# EAGLE design Metro M4 Express AirLift (EAGLE 9.3.2)
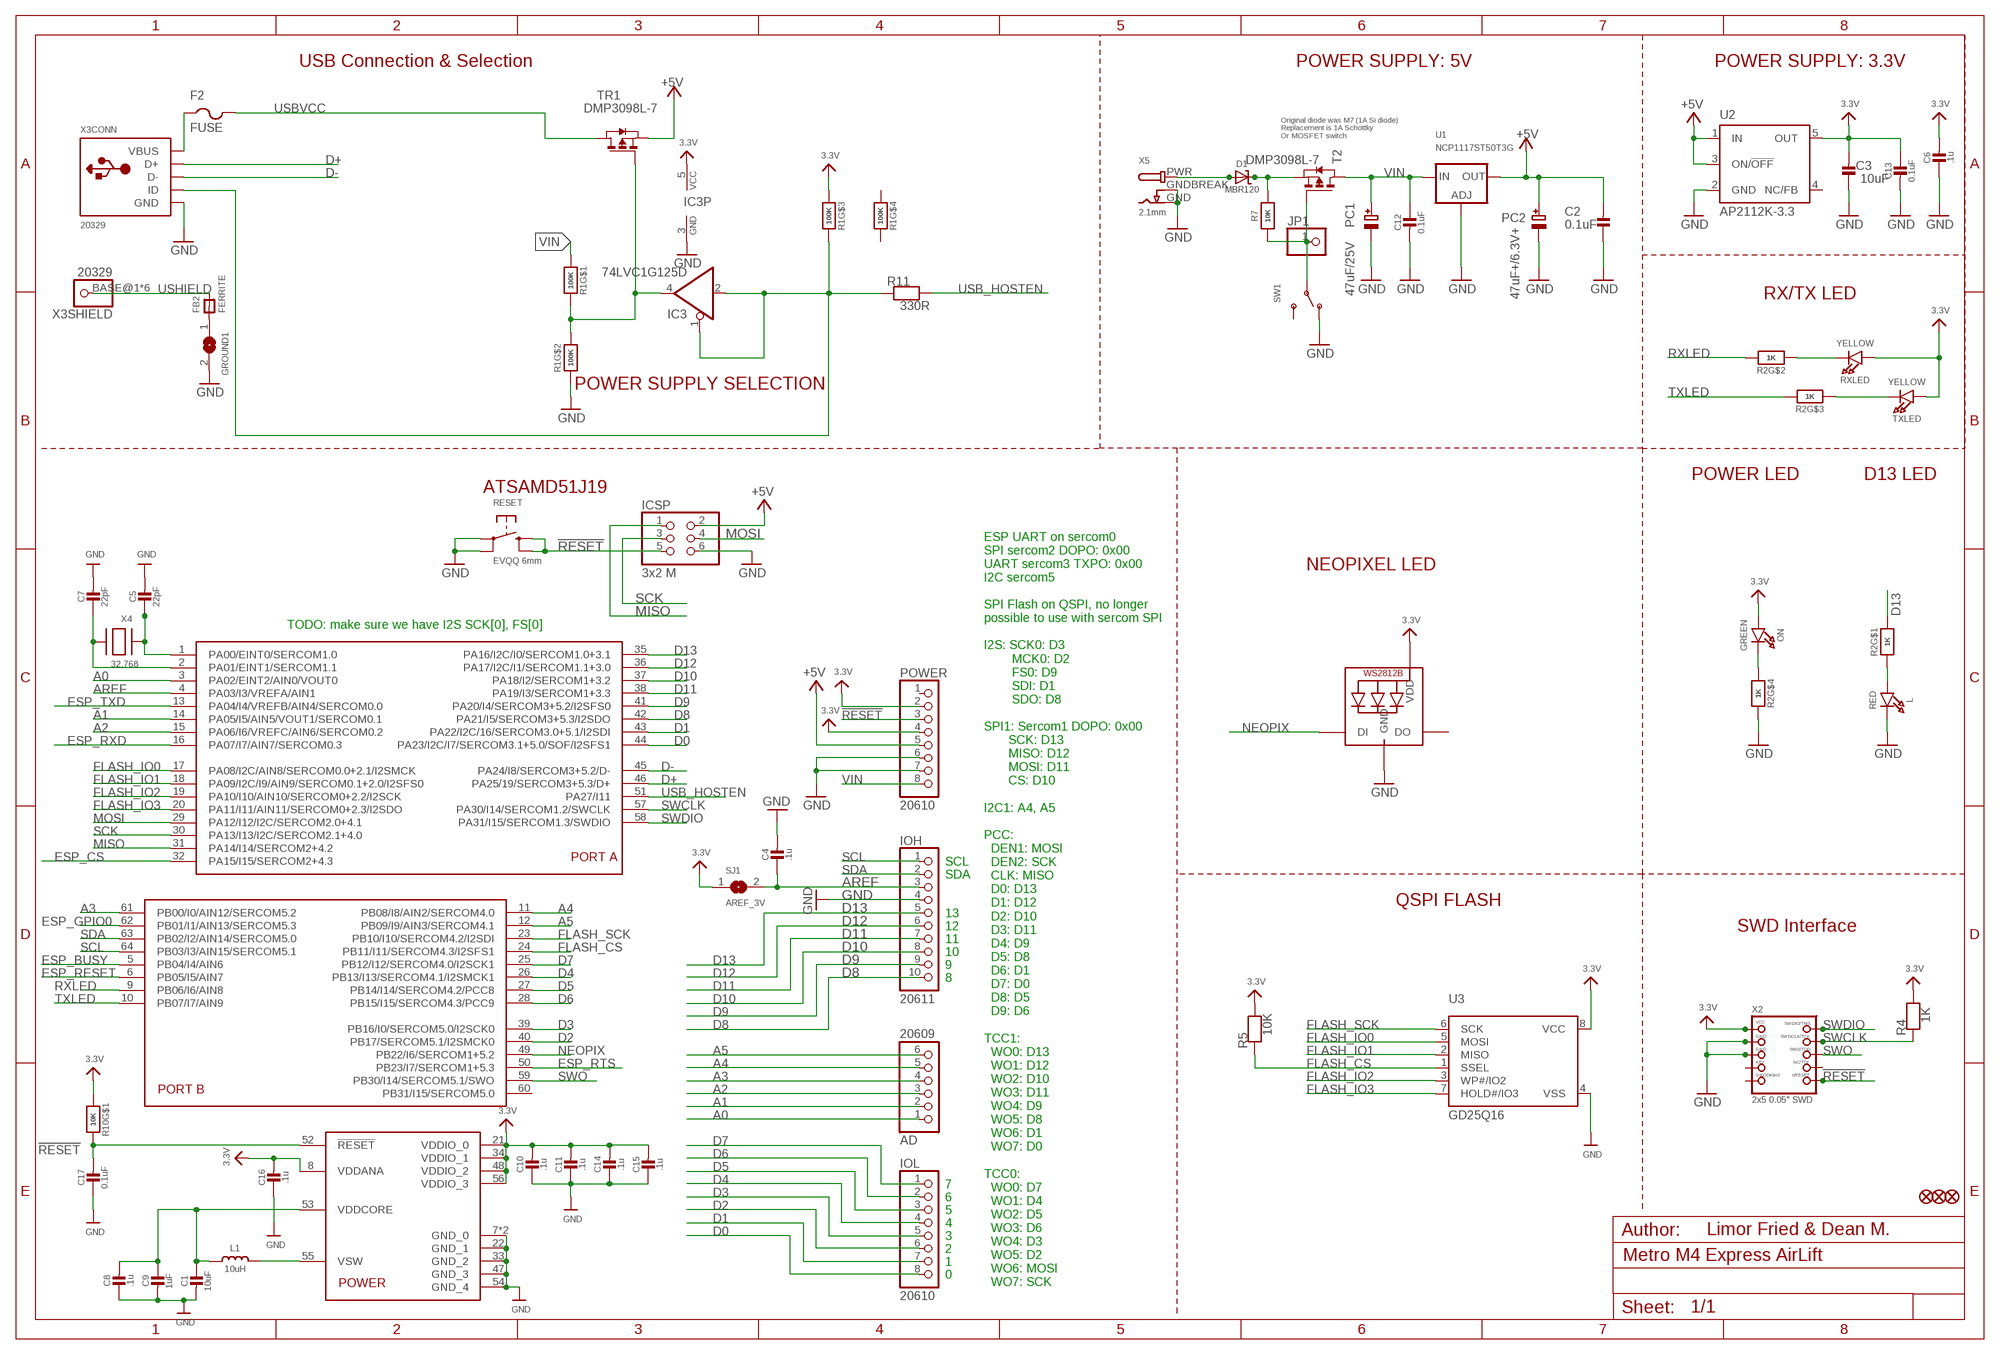
[diagram p0: schematic, sheet 1, part 1 of 2]
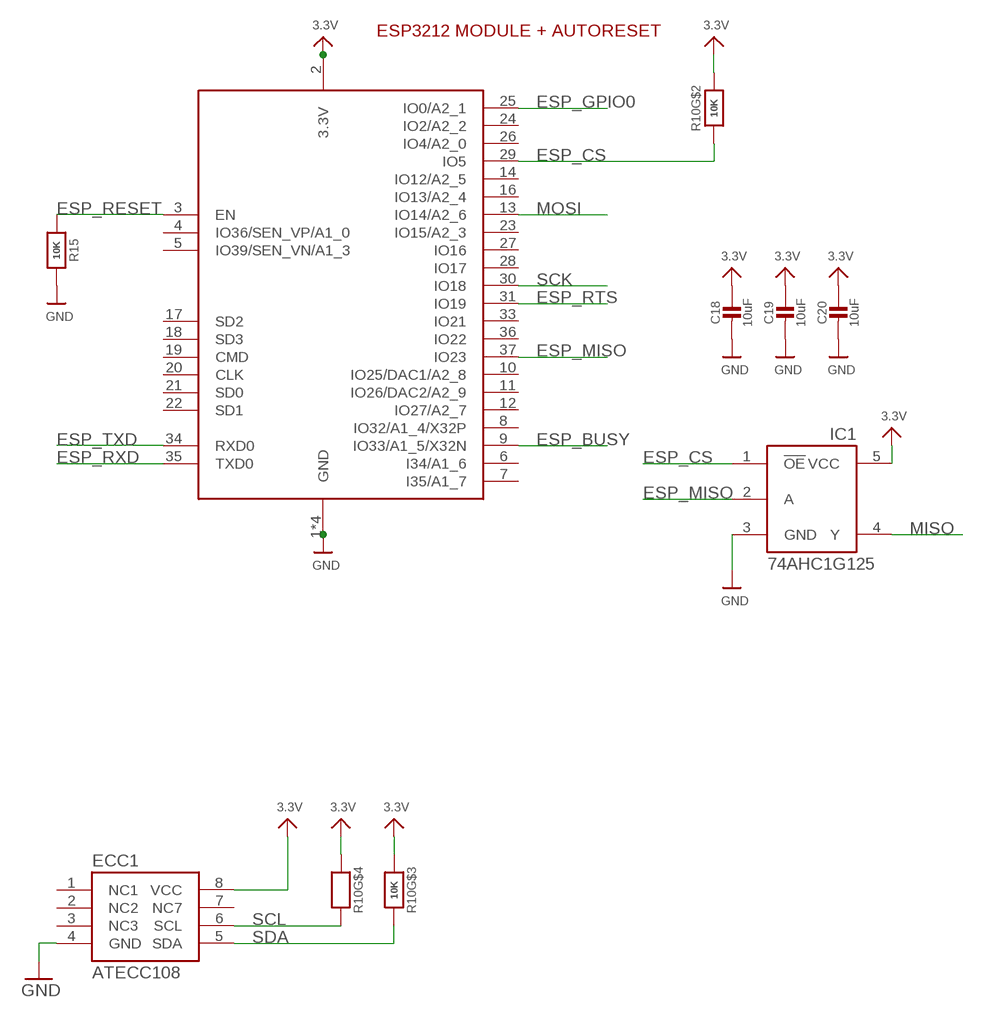
[diagram p1: schematic, sheet 1, part 2 of 2]

## Parts
AD  20609  HEADER-1X6OVALWAVE  [1X06_OVALWAVE]
C1  10uF  CAP_CERAMIC0805-NOOUTLINE  [0805-NO]
C2  0.1uF  CAP_CERAMIC0805-NOOUTLINE  [0805-NO]
C3  10uF  CAP_CERAMIC0805-NOOUTLINE  [0805-NO]
C4  .1u  CAP_CERAMIC0603_NO  [0603-NO]
C5  22pF  CAP_CERAMIC0603_NO  [0603-NO]
C6  .1u  CAP_CERAMIC0603_NO  [0603-NO]
C7  22pF  CAP_CERAMIC0603_NO  [0603-NO]
C8  .1u  CAP_CERAMIC0603_NO  [0603-NO]
C9  1uF  CAP_CERAMIC0603_NO  [0603-NO]
C10  .1u  CAP_CERAMIC0603_NO  [0603-NO]
C11  .1u  CAP_CERAMIC0603_NO  [0603-NO]
C12  0.1uF  CAP_CERAMIC0603_NO  [0603-NO]
C13  0.1uF  CAP_CERAMIC0603_NO  [0603-NO]
C14  .1u  CAP_CERAMIC0603_NO  [0603-NO]
C15  .1u  CAP_CERAMIC0603_NO  [0603-NO]
C16  .1u  CAP_CERAMIC0603_NO  [0603-NO]
C17  0.1uF  CAP_CERAMIC0603_NO  [0603-NO]
C18  10uF  CAP_CERAMIC0805-NOOUTLINE  [0805-NO]
C19  10uF  CAP_CERAMIC0805-NOOUTLINE  [0805-NO]
C20  10uF  CAP_CERAMIC0805-NOOUTLINE  [0805-NO]
D1  MBR120  DIODE-SCHOTTKYSOD-123  [SOD-123]
ECC1  ATECC108  [SOIC8]
F2  FUSE  PTCFUSE-1206  [R1206]
FB2  FERRITE  FERRITE-0805NO  [0805-NO]
FD1  FIDUCIAL_1MM  [FIDUCIAL_1MM]
FD2  FIDUCIAL_1MM  [FIDUCIAL_1MM]
FD3  FIDUCIAL_1MM  [FIDUCIAL_1MM]
GROUND1  SOLDERJUMPERCLOSED  [SOLDERJUMPER_CLOSEDWIRE]
IC1  74AHC1G125  [SOT23-5L]
IC3  74LVC1G125D  74AHC1G125DBV  [SOT23-5]
ICSP  3x2 M  HEADER-2X3  [2X03_ROUND_70MIL]
IOH  20611  HEADER-1X10OVALWAVE  [1X10_OVALWAVE]
IOL  20610  HEADER-1X8OVALWAVE  [1X08_OVALWAVE]
JP1  HEADER-1X1ROUND  [1X01_ROUND]
L  RED  LED0805_NOOUTLINE  [CHIPLED_0805_NOOUTLINE]
L1  10uH  INDUCTOR  [INDUCTOR_1007]
LED1  WS2812B3535  [LED3535]
ON  GREEN  LED0805_NOOUTLINE  [CHIPLED_0805_NOOUTLINE]
PC1  47uF/25V  CAP_ELECTROLYTICPANASONIC_D  [PANASONIC_D]
PC2  47uF+/6.3V+  CAP_ELECTROLYTICPANASONIC_D  [PANASONIC_D]
POWER  20610  HEADER-1X8OVALWAVE  [1X08_OVALWAVE]
R1  100K  RESISTOR_4PACK  [RESPACK_4X0603]
R2  1K  RESISTOR_4PACK  [RESPACK_4X0603]
R4  1K  RESISTOR_0603_NOOUT  [0603-NO]
R5  10K  RESISTOR_0603_NOOUT  [0603-NO]
R7  10K  RESISTOR_0603_NOOUT  [0603-NO]
R10  10K  RESISTOR_4PACK  [RESPACK_4X0603]
R11  330R  RESISTOR_0603_NOOUT  [0603-NO]
R15  10K  RESISTOR_0603_NOOUT  [0603-NO]
RESET  EVQQ 6mm  SWITCH_TACT_SMT_EVQQ2_SMALL  [EVQ-Q2_SMALLER]
RXLED  YELLOW  LED0805_NOOUTLINE  [CHIPLED_0805_NOOUTLINE]
SJ1  AREF_3V  SOLDERJUMPERCLOSED  [SOLDERJUMPER_CLOSEDWIRE]
SW1  SWITCH_SPDT  [SPDT_SMT_SSSS811101]
T2  DMP3098L-7  PMOSSOT23  [SOT-23]
TR1  DMP3098L-7  0297_PMV48XP  [SOT-23]
TXLED  YELLOW  LED0805_NOOUTLINE  [CHIPLED_0805_NOOUTLINE]
U1  NCP1117ST50T3G  LM1117SOT223-REFLOW  [SOT223-R]
U2  AP2112K-3.3  LP2985-XXDBVR33  [SOT23-DBV]
U3  GD25Q16  SPIFLASH_8PIN208MIL  [SOIC8_208MIL]
U$1  ATSAMD51J19  ATSAMD51J  [PQFN64-1]
X2  2x5 0.05" SWD  JTAG-CORTEXBOXPOSTS  [2X05_1.27MM_BOX_POSTS]
X3  20329  USB_W_SHIELD_V2  [4UCONN_20329_V2]
X4  32.768  XTAL-3.2X1.5  [XTAL3215]
X5  2.1mm  DCBARRELPTH  [DCJACK_2MM_PTH]
X6  ESP32_WROOM32  [WROOM32]

## Nets
3.3V: C3.2 C6.2 C10.2 C11.2 C13.1 C14.2 C15.2 C16.2 C18.1 C19.1 C20.1 ECC1.8(VCC) IC1.5(VCC) IC3.5(VCC) LED1.2(VDD) ON.A POWER.2 POWER.4 R1.3 R4.2 R5.2 R10.1 R10.3 R10.4 R10.7 RXLED.A SJ1.1 TXLED.A U2.5(OUT) U3.8(VCC) U$1.8(VDDANA) U$1.21(VDDIO_0) U$1.34(VDDIO_1) U$1.48(VDDIO_2) U$1.56(VDDIO_3) X2.1(VCC) X6.2(3.3V)
!RESET: C17.2 ICSP.5 POWER.3 R10.8 RESET.B'(S1) RESET.B(S) U$1.52(!RESET) X2.10(NRESET)
+5V [usbvcc]: C2.2 ICSP.2 PC2.+ POWER.5 TR1.2(S) U1.2(OUT) U1.4(OUT) U2.1(IN) U2.3(ON/!OFF)
A0: AD.1 U$1.3(PA02/EINT2/AIN0/VOUT0)
A1: AD.2 U$1.14(PA05/I5/AIN5/VOUT1/SERCOM0.1)
A2: AD.3 U$1.15(PA06/I6/VREFC/AIN6/SERCOM0.2)
A3: AD.4 U$1.61(PB00/I0/AIN12/SERCOM5.2)
A4: AD.5 U$1.11(PB08/I8/AIN2/SERCOM4.0)
A5: AD.6 U$1.12(PB09/I9/AIN3/SERCOM4.1)
AREF [aref]: C4.1 IOH.3 SJ1.2 U$1.4(PA03/I3/VREFA/AIN1)
D0: IOL.8 U$1.44(PA23/I2C/I7/SERCOM3.1+5.0/SOF/I2SFS1)
D1: IOL.7 U$1.43(PA22/I2C/16/SERCOM3.0+5.1/I2SDI)
D2: IOL.6 U$1.40(PB17/SERCOM5.1/I2SMCK0)
D3: IOL.5 U$1.39(PB16/I0/SERCOM5.0/I2SCK0)
D4: IOL.4 U$1.26(PB13/I13/SERCOM4.1/I2SMCK1)
D5: IOL.3 U$1.27(PB14/I14/SERCOM4.2/PCC8)
D6: IOL.2 U$1.28(PB15/I15/SERCOM4.3/PCC9)
D7: IOL.1 U$1.25(PB12/I12/SERCOM4.0/I2SCK1)
D8: IOH.10 U$1.42(PA21/I5/SERCOM3+5.3/I2SDO)
D9: IOH.9 U$1.41(PA20/I4/SERCOM3+5.2/I2SFS0)
D10: IOH.8 U$1.37(PA18/I2/SERCOM1+3.2)
D11: IOH.7 U$1.38(PA19/I3/SERCOM1+3.3)
D12: IOH.6 U$1.36(PA17/I2C/I1/SERCOM1.1+3.0)
D13: IOH.5 R2.8 U$1.35(PA16/I2C/I0/SERCOM1.0+3.1)
D+: U$1.46(PA25/19/SERCOM3+5.3/D+) X3.D+(CONN:D+)
D-: U$1.45(PA24/I8/SERCOM3+5.2/D-) X3.D-(CONN:D-)
ESP_BUSY: U$1.5(PB04/I4/AIN6) X6.9(IO33/A1_5/X32N)
ESP_CS: IC1.1(!OE) R10.2 U$1.32(PA15/I15/SERCOM2+4.3) X6.29(IO5)
ESP_GPIO0: U$1.62(PB01/I1/AIN13/SERCOM5.3) X6.25(IO0/A2_1)
ESP_MISO: IC1.2(A) X6.37(IO23)
ESP_RESET: R15.1 U$1.6(PB05/I5/AIN7) X6.3(EN)
ESP_RTS: U$1.50(PB23/I7/SERCOM1+5.3) X6.31(IO19)
ESP_RXD: U$1.16(PA07/I7/AIN7/SERCOM0.3) X6.35(TXD0)
ESP_TXD: U$1.13(PA04/I4/VREFB/AIN4/SERCOM0.0) X6.34(RXD0)
FLASH_CS: R5.1 U3.1(SSEL) U$1.24(PB11/I11/SERCOM4.3/I2SFS1)
FLASH_IO0: U3.5(MOSI) U$1.17(PA08/I2C/AIN8/SERCOM0.0+2.1/I2SMCK)
FLASH_IO1: U3.2(MISO) U$1.18(PA09/I2C/I9/AIN9/SERCOM0.1+2.0/I2SFS0)
FLASH_IO2: U3.3(WP#/IO2) U$1.19(PA10/I10/AIN10/SERCOM0+2.2/I2SCK)
FLASH_IO3: U3.7(HOLD#/IO3) U$1.20(PA11/I11/AIN11/SERCOM0+2.3/I2SDO)
FLASH_SCK: U3.6(SCK) U$1.23(PB10/I10/SERCOM4.2/I2SDI)
GND [gnd]: C1.2 C2.1 C3.1 C4.2 C5.2 C6.1 C7.2 C8.1 C9.2 C10.1 C11.1 C12.2 C13.2 C14.1 C15.1 C16.1 C17.1 C18.2 C19.2 C20.2 ECC1.4(GND) GROUND1.2 IC1.3(GND) IC3.3(GND) ICSP.6 IOH.4 L.C LED1.4(GND) PC1.- PC2.- POWER.6 POWER.7 R1.2 R2.5 R15.2 RESET.A'(P1) RESET.A(P) SW1.A(O) U1.1(ADJ) U2.2(GND) U3.4(VSS) U$1.7(GND_0) U$1.22(GND_1) U$1.33(GND_2) U$1.47(GND_3) U$1.54(GND_4) U$1.EXP(GND_0) X2.3(GND) X2.5(GND) X3.GND(CONN:GND) X5.GND X5.GNDBREAK X6.1(GND) X6.15(GND) X6.38(GND) X6.P$1(GND)
MISO: IC1.4(Y) ICSP.1 U$1.31(PA14/I14/SERCOM2+4.2)
MOSI: ICSP.4 U$1.29(PA12/I12/I2C/SERCOM2.0+4.1) X6.13(IO14/A2_6)
N$1: L.A R2.1
N$2: FB2.1 GROUND1.1
N$3: ON.C R2.4
N$4: L1.P$2 U$1.55(VSW)
N$5: R2.2 RXLED.C
N$7: R2.3 TXLED.C
N$9: C5.1 U$1.1(PA00/EINT0/SERCOM1.0) X4.P$1
N$10: IC3.1(OE) IC3.2(I) R1.6 R11.1 X3.ID(CONN:ID)
N$11: IC3.4(O) R1.7 R1.8 TR1.3(G)
N$12: C7.1 U$1.2(PA01/EINT1/SERCOM1.1) X4.P$2
N$15: D1.C R7.2 T2.2(S)
NEOPIX: LED1.1(DI) U$1.49(PB22/I6/SERCOM1+5.2)
PWR_SWITCH: JP1.1 R7.1 SW1.B(P) T2.3(G)
PWRIN [power]: D1.A X5.PWR
RXLED: R2.7 U$1.9(PB06/I6/AIN8)
SCK: ICSP.3 U$1.30(PA13/I13/I2C/SERCOM2.1+4.0) X6.30(IO18)
SCL: ECC1.6(SCL) IOH.1 R10.5 U$1.64(PB03/I3/AIN15/SERCOM5.1)
SDA: ECC1.5(SDA) IOH.2 R10.6 U$1.63(PB02/I2/AIN14/SERCOM5.0)
SWCLK: R4.1 U$1.57(PA30/I14/SERCOM1.2/SWCLK) X2.4(SWDCLK)
SWDIO: U$1.58(PA31/I15/SERCOM1.3/SWDIO) X2.2(SWDIO)
SWO: U$1.59(PB30/I14/SERCOM5.1/SWO) X2.6(SWO)
TXLED: R2.6 U$1.10(PB07/I7/AIN9)
USB_HOSTEN: R11.2 U$1.51(PA27/I11)
USBVCC [usbvcc]: F2.2 TR1.1(D)
USHIELD [gnd]: FB2.2 X3.BASE@1 X3.BASE@2 X3.SPRT@1 X3.SPRT@2 X3.SPRT@3 X3.SPRT@4
VBUS: F2.1 X3.VBUS(CONN:VBUS)
VDDCORE: C1.1 C8.2 C9.1 L1.P$1 U$1.53(VDDCORE)
VIN [power]: C12.1 PC1.+ POWER.8 R1.1 T2.1(D) U1.3(IN)
Unconnected: ECC1.1(NC1) ECC1.2(NC2) ECC1.3(NC3) ECC1.7(NC7) LED1.3(DO) POWER.1 R1.4 R1.5 SW1.C(S) U2.4(NC/FB) U$1.60(PB31/I15/SERCOM5.0) X2.7(KEY) X2.8(TDI) X2.9(GNDDETECT) X6.4(IO36/SEN_VP/A1_0) X6.5(IO39/SEN_VN/A1_3) X6.6(I34/A1_6) X6.7(I35/A1_7) X6.8(IO32/A1_4/X32P) X6.10(IO25/DAC1/A2_8) X6.11(IO26/DAC2/A2_9) X6.12(IO27/A2_7) X6.14(IO12/A2_5) X6.16(IO13/A2_4) X6.17(SD2) X6.18(SD3) X6.19(CMD) X6.20(CLK) X6.21(SD0) X6.22(SD1) X6.23(IO15/A2_3) X6.24(IO2/A2_2) X6.26(IO4/A2_0) X6.27(IO16) X6.28(IO17) X6.33(IO21) X6.36(IO22)

## Notes on the sheet
- USB Connection & Selection | POWER SUPPLY: 5V | POWER SUPPLY: 3.3V
- Original diode was M7 (1A Si diode)
  Replacement is 1A Schottky
  Or MOSFET switch
- RX/TX LED
- POWER SUPPLY SELECTION
- POWER LED | D13 LED
- ATSAMD51J19
- ESP3212 MODULE + AUTORESET
- NEOPIXEL LED
- TODO: make sure we have I2S SCK[0], FS[0]
- SCL
- SDA
- QSPI FLASH
- 13
- 12 | SWD Interface
- 11
- 10
- 9
- 8
- 7
- 6
- 5
- 4
- 3 | Limor Fried & Dean M.
- 2
- 1
- 0
- ESP UART on sercom0
  SPI sercom2 DOPO: 0x00
  UART sercom3 TXPO: 0x00
  I2C sercom5
  
  SPI Flash on QSPI, no longer
  possible to use with sercom SPI
  
  I2S: SCK0: D3
          MCK0: D2
          FS0: D9
          SDI: D1
          SDO: D8
  
  SPI1: Sercom1 DOPO: 0x00
         SCK: D13
         MISO: D12
         MOSI: D11
         CS: D10
  
  I2C1: A4, A5
  
  PCC:
    DEN1: MOSI
    DEN2: SCK
    CLK: MISO
    D0: D13
    D1: D12
    D2: D10
    D3: D11
    D4: D9
    D5: D8
    D6: D1
    D7: D0
    D8: D5
    D9: D6
  
  TCC1:
    WO0: D13
    WO1: D12
    WO2: D10
    WO3: D11
    WO4: D9
    WO5: D8
    WO6: D1
    WO7: D0
  
  TCC0:
    WO0: D7
    WO1: D4
    WO2: D5
    WO3: D6
    WO4: D3
    WO5: D2
    WO6: MOSI
    WO7: SCK

## Library data of the parts
AD = microbuilder:HEADER-1X6: PIN HEADER
C1-C20 = microbuilder:CAP_CERAMIC: Ceramic Capacitors For new designs, use the packages preceded by an '_' character since they are more reliable: The following footprints should be used on most boards: _0402 - Standard footprint for regular board layouts _0603 - Standard footprint for regular board layouts _0805 - Standard footprint for regular board layouts _1206 - Standard footprint for regular board layouts For extremely tight-pitch boards where space is at a premium, the following 'micro-pitch' footprints can be used (smaller pads, no silkscreen outline, etc.): _0402MP - Micro-pitch footprint for very dense/compact boards _0603MP - Micro-pitch footprint for very dense/compact boards _0805MP - Micro-pitch footprint for very dense/compact boards _1206MP - Micro-pitch footprint for very dense/compact boards
D1 = microbuilder:DIODE-SCHOTTKY
ECC1 = cryptotronix:ATECC108: ATECC108: Provides ECDSA with NIST curves P256, B283, and K283. Also, a RNG, 8.5Kb EEPROM. 2.0V - 5.5V.
F2 = adafruit:PTCFUSE: PTC fuses, resettable thermistors
FB2 = microbuilder:FERRITE: Ferrite Bead 0603 MMZ1608B121C - 120 Ohm @ 100MHz, 600mA, 0.15 Ohm DC Resistance - Digikey: 445-2164-1-ND BK1608HW121-T - 120 Ohm, 600mA Ferrite Chip - Digikey: 587-1876-2-ND 0805 HZ0805B272R-10 - 2.7K Ohm @ 100MHz, 200mA, 0.8 Ohm DC Resistance - Digikey: 240-2504-1-ND (see also Murata BLM21BD272SN1L) MMZ2012Y152B - 1.5K Ohm @ 100MHz, 500mA, 0.4 Ohm DC Resistance - Digikey: 445-1560-1-ND - Mainly for high frequency (80-400MHz) MMZ2012R102A - 1K Ohm @ 100MHz, 500mA, 0.3 Ohm DC Resistance - Digikey: 445-1555-2-ND - More general purpose (10-200MHz)
FD1-FD3 = microbuilder:FIDUCIAL: Fiducial Alignment Points Various fiducial points for machine vision alignment.; BOM: EXCLUDE
GROUND1 SJ1 = microbuilder:SOLDERJUMPER: SMD Solder JUMPER Solder the two pads together to create a connection, or remove the solder to break it. REFLOW - Use this footprint for solder paste and reflow ovens. WAVE - Use this footprint for hand-soldering (larger pads). CLOSED - Has a trace between the two pads to ensure it is closed by default. The trace needs to be cut to disable the jumper, and can be closed again by creating a solder bridge between the two pads.
IC1 = adafruit:74AHC1G125
IC3 = 74xx-little-de:74*1G125: Single Bus Buffer Gate with 3-State Output
ICSP = microbuilder:HEADER-2X3: PIN HEADER
IOH = microbuilder:HEADER-1X10: PIN HEADER
IOL POWER = microbuilder:HEADER-1X8: PIN HEADER
JP1 = microbuilder:HEADER-1X1: PIN HEADER
L ON RXLED TXLED = microbuilder:LED: LED 0603 - 0603 Surface Mount Package 2mA: Green LED - Low Power (3.9mcd, 2ma, 1.7Vf) - Digikey: 475-2709-2-ND Orange LED - Low Power (9.8mcd, 2ma, 1.8Vf) - Digikey: 475-1194-2-ND Red LED - Low Power (5mcd, 2ma, 1.8Vf) - Digikey: 475-1195-2-ND Yellow LED - Low Power (7mcd, 2ma, 1.8Vf) - Digikey: 475-1196-2-ND 5mA: Blue LED - Low Power (17mcd, 5ma, 2.9Vf) - Digikey: LNJ937W8CRACT-ND 0805 - 0805 Surface Mount Package 2mA: Red LED (8.8mcd, 2mA, 1.8Vf, Clear) - Low Power [Digikey: 475-2510-1-ND] Green LED (5mcd, 2mA, 1.8Vf, Clear) - Low Power [Digikey: 475-2730-1-ND] Yellow LED (11.3mcd, 2mA, 1.8Vf, Clear) - Low Power [Digikey: 475-2555-1-ND] 20mA: Red LED (104mcd, 20mA, Diffused) - LS R976 [Digikey: 475-1278-6-ND] Red LED (12mcd, 20mA, 2.0Vf, Clear) - APT2012EC [Digikey: 754-1128-1-ND] Green LED (15mcd, 20mA, 2.2Vf, Clear) - APT2012GC [Digikey: 754-1131-1-ND] Orange LED (160mcd, 20mA, 2.1Vf, Clear) - APT2012SECK [Digikey: 754-1130-1-ND] 1206 - 1206 Surface Mount Package Green LED (26mcd, 20mA, Diffused) - LG N971 [Digikey: 475-1407-6-ND] Red LED (15mcd, 20mA, Diffused) - LH N974 [Digikey: 475-1416-6-ND] Cree - Cree High-Power Surface Mount LEDs XPEBWT-L1-0000-00D50 - White 111lm 350mA 2.9Vf 6200K 110° XTEAWT-00-0000-00000LEE3 - White 114lm 350mA 2.85Vf 5000K 115° Everlight - Everlight 45-21 Series Surface Mount LEDs 45-21/QK2C-B2832AC2CB2/2T - Warm White 2000mcd 20mA 3.25Vf 3050K 120° 45-21/LK2C-B38452C4CB2/2T - Nuetral White 2000mcd 20mA 3.25Vf 4150K 120° 45-21/LK2C-B50634C6CB2/2T - Cold White 2200mcd 20mA 3.25Vf 5650K 120° PLCC2 Reverse Mount LS T77K-J1L2-1-0-2-R18-Z - Red 11.25mcd 2mA 1.8Vf 630nm 120° LO T77K-L1M2-24-Z - Orange 19.6mcd 2mA 1.8Vf 606nm 120° LY T77K-K2M1-26-Z - Yellow 15.7mcd 2mA 1.8Vf 587nm 120°
L1 = microbuilder:INDUCTOR: Inductors 0603: 10nH Ceramic Inductor - microwire antenna/RF (Digikey: 712-1434-2-ND) 0805: 560nH Ceramic Inductor - RF (Digikey: 553-1047-1-ND) 270nH Ceramic Inductor - Q = 40@250MHz, +-5%, 1 Ohm DC Resistance (Digikey: 535-10506-2-ND) 1007 (2518 Metric) SMT: 10µH 10% 250mOhm 820mA 1007 Inductor (Digikey: 587-2189-1-ND) 22µH 10% 500mOhm 580mA 1007 Inductor (Digikey: 587-2190-1-ND) 47µH 10% 950mOhm 420mA 1007 Inductor (Digikey: 587-2191-1-ND) 47µH 5% 100mOhm 1A 1008 Inductor (Digikey: 732-1816-1-ND) 5.0x5.0mm (Taiyo Yuden NR5040 Series) 6.8µH 20% 2.3A 64mOhm Inductor (Digikey: 587-2374-2-ND) 5.0x5.0mm (TDK VLC5045 Series) 4.7µH 20% 3.3A 34mOhm Inductor (Digikey: 445-6526-1-ND) 6.8µH 20% 2.7A 46mOhm Inductor (Digikey: 445-6527-1-ND) 6.0x6.0mm (TDK VLC6045 Series) 4.7µH 20% 3.8A 27mOhm Inductor (Digikey: 445-6538-2-ND) 6.8µH 20% 3A 41mOhm Inductor (Digikey: 445-6540-1-ND) 6.2µH 30% 2.2A 45mOhm Inductor (Digikey: SRR5028-6R2YCT-ND) - Not TDK VLC6045 but footprint should match 6.0x6.0mm (TDK SLF6045 Series) 6.8uH 30% 2A 33mOhm Inductor (Digikey: 445-4572-1-ND, Mouser: 810-SLF645T6R8N2R0PF) 6.0x6.0mm (Sumida CDRH5D28 Series) 6.2uH 30% 1.8A 45mOhm Inductor (Digikey: 308-1542-1-ND) Taiyo Yuden NR3015T2R2M - 2.2uH 20% 1.5A (Digikey: 587-1648-2-ND, Mouser: 963-NR3015T2R2M) - Used with TI TPS62172 CoilCraft RFID Transponder Coil - MA5532-AE (For use with AS3935 Lightning Sensor) Taiyo Yuden NRH2412T2R2MNGH - 2.2uH 20% 1AA (Digikey: 587-3443-1-ND) - Used with TI LM3671 Vishay IHLP 1.0uH Molded Inductor - 24mOhm DCR, 5A, +/-20%, -55°C-125°C (Digikey: 541-1319-1-ND)
LED1 = microbuilder:WS2812B
PC1 PC2 = microbuilder:CAP_ELECTROLYTIC: Electrolytic Capacitors SMT PANASONIC_C - Size C Panasonic Electrolytic Aluminum Capacitor 47µF 16V 20% Electrolytic Capacitor [Digikey: PCE3890TR-ND] PANASONIC_D - Size D Panasonic Electrolytic Aluminum Capacitor 100µF 25V 20% Electrolytic Capacitor [Digikey: PCE3898TR-ND] PTH 3.5 mm grid, 8 mm diameter ... 3.5 mm grid, 10 mm diameter ...
R1 R2 R10 = microbuilder:RESISTOR_4PACK: Resistor Packs (4 resistors) 4 x 0603 10K 1/16W - Digikey: YC164J-10KCT-ND
R4 R5 R7 R11 R15 = microbuilder:RESISTOR: Resistors For new designs, use the packages preceded by an '_' character since they are more reliable: The following footprints should be used on most boards: _0402 - Standard footprint for regular board layouts _0603 - Standard footprint for regular board layouts _0805 - Standard footprint for regular board layouts _1206 - Standard footprint for regular board layouts For extremely tight-pitch boards where space is at a premium, the following 'micro-pitch' footprints can be used (smaller pads, no silkscreen outline, etc.): _0402MP - Micro-pitch footprint for very dense/compact boards _0603MP - Micro-pitch footprint for very dense/compact boards _0805MP - Micro-pitch footprint for very dense/compact boards _1206MP - Micro-pitch footprint for very dense/compact boards
RESET = microbuilder:SWITCH_TACT_SMT: SMT Tact Switches 6x6mm - Digikey: P12940SCT-ND KMR2 (4.6x2.8mm) - Digikey: 401-1426-1-ND EVQ-PQHB55 - Light Touch, 160GF (4.5x4.5mm) - Digikey: P8090SCT-ND KMT0 - KMT021 NGJ LHS (etc.) IP68/Waterproof - Digikey: CKN10289CT-ND
SW1 = microbuilder:SWITCH_SPDT: Switch - SPDT SSSS811101 - Horizontal Two Position SMT, 0.3A 4V [Mouser: 688-SSSS811101]
T2 = zetex:PMOSSOT23: MOS FET; OC_FARNELL: unknown; OC_NEWARK: unknown
TR1 = Transistors:0297_PMV48XP: 20 V, 3.5 A P-channel Trench MOSFET - PMV48XP; CASE: SOT23; MONTHLY_USAGE: _____; PART_NUMBER: PMV48XP; PRICE: _____; SUPPLIER: _____; TYPE: Transistor; VALUE: PMV48XP
U1 = microbuilder:LM1117: LM1117 Voltage Regulator LM1117 Adjustable Voltage regulator [Digikey: LM1117IMP-ADJDKR-ND] LM1117 3.3V Voltage regulator [AP1117E33GDIDKR-ND] LM1117 5.0V Voltage regulator [AP1117E50GDIDKR-ND] SOT223-REFLOW - SOT223 package for solder paste/reflow ovens SOT223-WAVE - SOT223 package for hand-soldering (larger pads) Note: For the fixed-voltage regulators, simply set the ADJ pin to GND.
U2 = SmartPrj:LP2985-XXDBVR: ULTRALOW-POWER 50-mA LOW-DROPOUT LINEAR REGULATORS 50-mA Low-Dropout Regulator Source: http://focus.ti.com/lit/ds/symlink/tps77001.pdf
U3 = microbuilder:SPIFLASH_8PIN: SOIC8 SPI Flash Be careful with the size since SOIC8 flash comes in several 'widths' SOIC8 150 mil M25P16 - 16Mbit (2Mbit x 8) Serial Flash (75MHz SPI Bus), Supply: 2.7-3.6V Digikey: SOIC8 - M25P16-VMN6P-ND SOIC8 208 mil W25Q16BVSSIG - 16Mbit (2Mbit x 8) Serial Flash (104MHz SPI Bus), Supply: 2.7-3.6V Digikey: SOIC8 - W25Q16BVSSIG-ND
U$1 = microbuilder:ATSAMD51J: ATSAMD51J cortex m4 microcontroller
X2 = microbuilder:JTAG-CORTEX: Serial Wire (SW-DP) Connector Standard 0.05" 10-pin connector is for use with the Cortex M and Cortex A SWD (serial wire debugger) interface (SW-DP) Connectors 2x05_1.27MM_SMT - Inexpensive surface-mount header with bare pins, compatible with standard 10-pin SWD cables (4UCON: 16846) 2x05_1.27MM_BOX_NOPOSTS - Polarised surface-mount box (4UCON with caps: 19735, without caps: 15117 2x05_1.27MM_BOX_POSTS - Polarised surface-mount box with mounting holes (4UCON: 20317) Pinout: http://infocenter.arm.com/help/topic/com.arm.doc.faqs/attached/13634/cortex_debug_connectors.pdf http://www.keil.com/peripherals/coresight/connectors.asp
X3 = microbuilder:USB_W_SHIELD
X4 = adafruit2:XTAL: Low cost SMT crystals, no capacitors included http://www.ladyada.net/library/eagle
X5 = microbuilder:DCBARREL: DC Barrel Jack DCJACK_1.3MM_PTH - Through Hole 1.3mm Jack (4UConnector: 05536) DCJACK_2MM_PTH - Through Hole 2.0/2.1 Jack (4UConnector: 05537) DCJACK_2MM_SMT - SMT 2.0/2.1mm Jack(4UConnector: 03267)
X6 = microbuilder:ESP32_WROOM32

## Net classes
1 power: width 0.305 mm

## Board
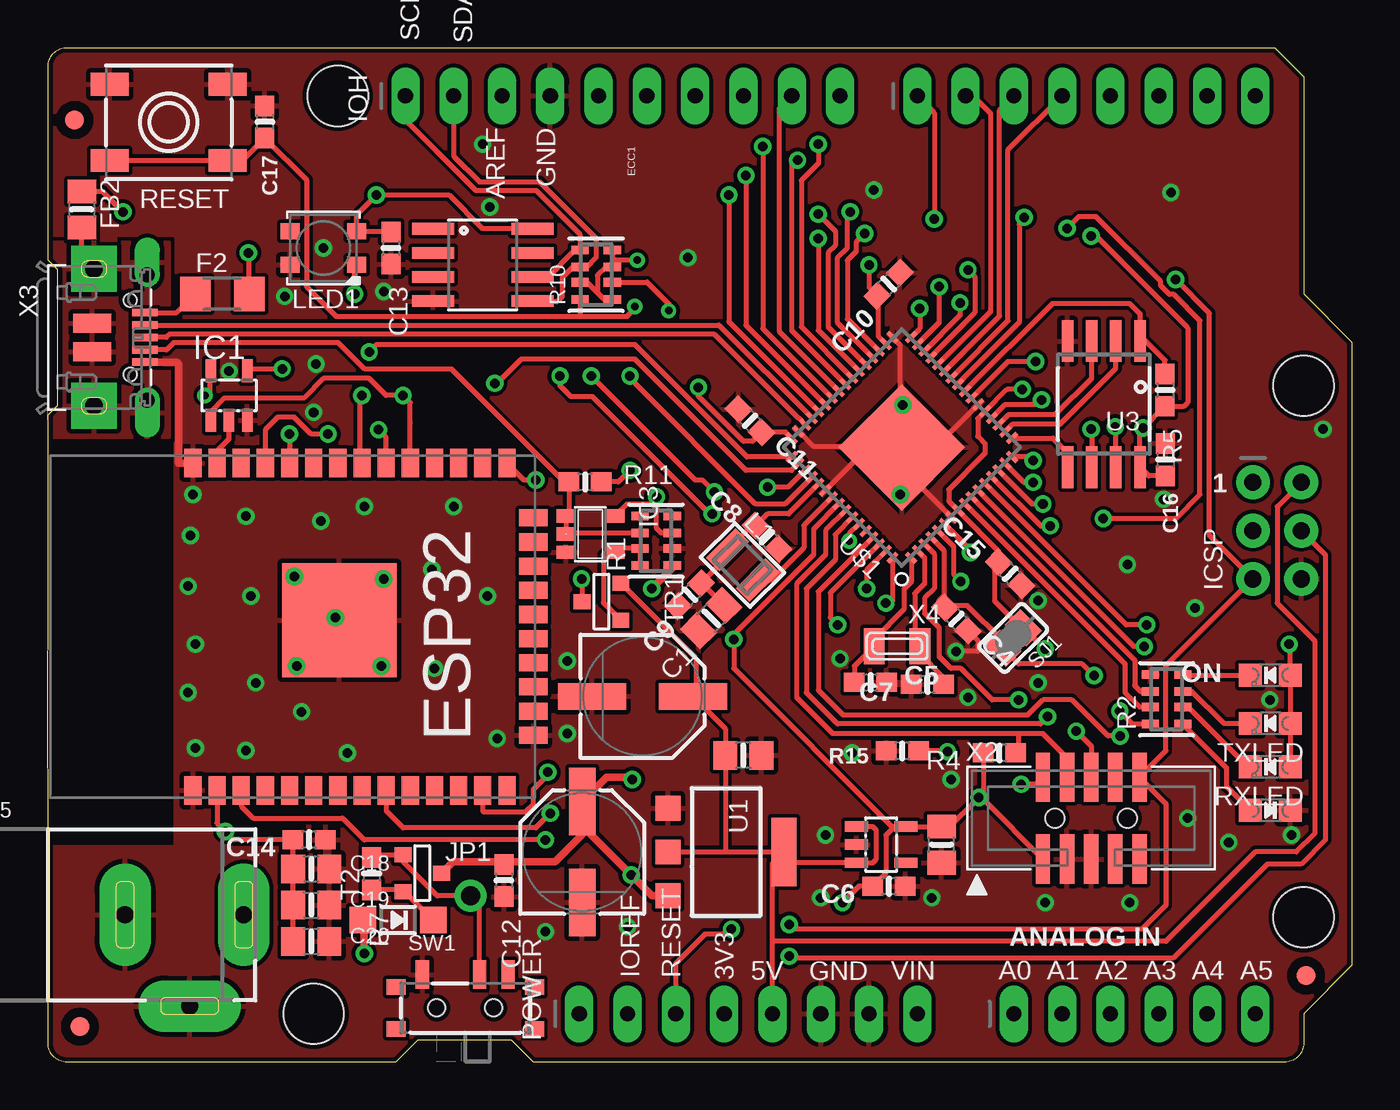
[diagram p2: board, top side]
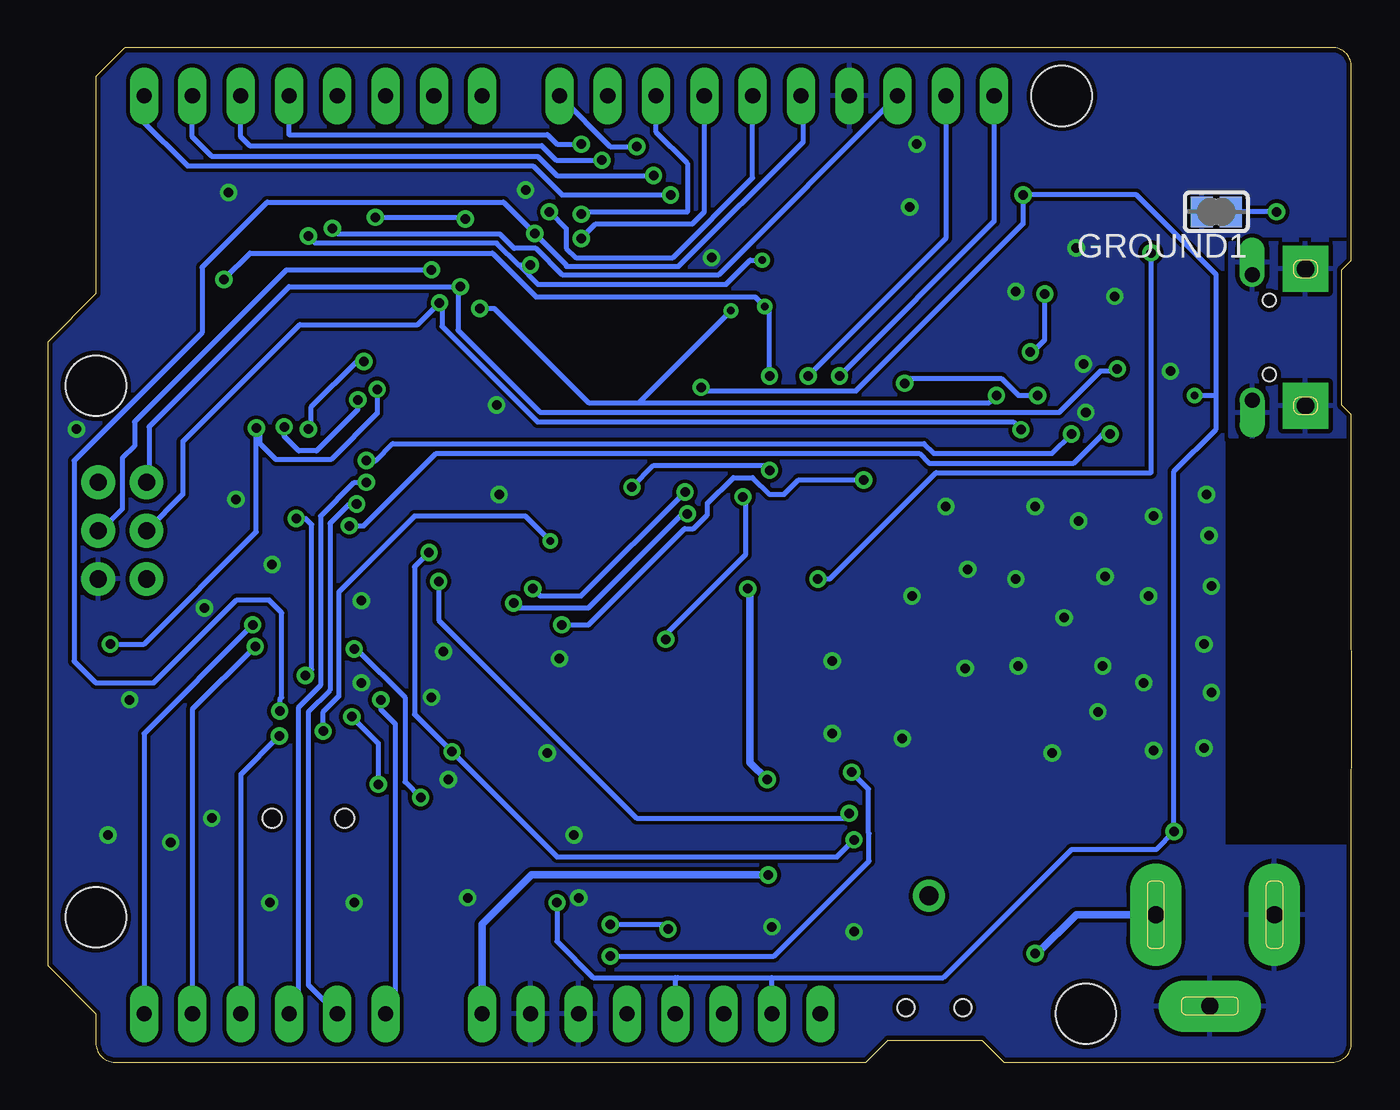
[diagram p3: board, bottom side, seen from below]

Size 68.61 x 53.34 mm. Coordinates in mm from the lower left corner, seen from the top.
Outline: 64.54,53.34 66.07,51.82 66.07,40.39 68.61,37.85 68.61,5.08 66.07,2.54 66.07,1 arc-90 65.07,0 25.55,0 24.41,1.14 19.46,1.14 18.31,0 1.03,0 arc-90 0.03,1 0.03,14.99 0,15.88 0,20.83 0.03,22.48 0.03,34.04 0.53,34.54 0.53,41.66 0.03,42.16 0.03,52.34 arc-90 1.03,53.34 64.54,53.34
Copper layers (1*16): Top 0.035mm / dielectric 1.5mm / Bottom 0.035mm
Design rules "adafruit *": minimum track width 8mil, minimum drill 15.5mil, track to track 8mil, track to pad 8mil, pad to pad 8mil, via to via 8mil, smd to smd 8mil, copper to edge 10mil, drill to drill 8mil, minimum pad ring 10mil, minimum via ring 8mil, stop-mask expansion 2mil, vias tented up to drill 20mil, thermal gap 10mil
Holes 3.17 mm at 66.07,35.56 66.07,7.62 15.27,50.8 14,2.54

### Footprints (pad centres in the part's own frame; a part is rotated, then mirrored left to right if it is on the bottom)
1X06_OVALWAVE = drill 0.8 pad 1.5 long: 1 -6.35,0; 2 -3.81,0; 3 -1.27,0; 4 1.27,0; 5 3.81,0; 6 6.35,0
0805-NO = smd 1.24 x 1.5: 1 -0.95,0; 2 0.95,0
0603-NO = smd 1.075 x 1: 1 -0.85,0; 2 0.85,0
SOD-123 = smd 1.4 x 1.4: A 1.85,0; C -1.85,0
SOIC8 = smd 0.61 x 2.21: 1 -1.905,-2.616; 2 -0.635,-2.616; 3 0.635,-2.616; 4 1.905,-2.616; 5 1.905,2.616; 6 0.635,2.616; 7 -0.635,2.616; 8 -1.905,2.616
R1206 = smd 1.6 x 1.803: 1 -1.422,0; 2 1.422,0
FIDUCIAL_1MM = smd 1 x 1: 1 0,0
SOLDERJUMPER_CLOSEDWIRE = smd 1.168 x 1.6: 1 -0.762,0; 2 0.762,0 | smd 0.635 x 0.203: WIRE 0,0
SOT23-5L = smd 0.55 x 1.2: 1 -0.95,-1.3; 2 0,-1.3; 3 0.95,-1.3; 4 0.95,1.3; 5 -0.95,1.3
SOT23-5 = smd 0.69 x 0.99: 1 -0.95,-1.29; 2 0,-1.29; 3 0.95,-1.29; 4 0.95,1.3; 5 -0.95,1.3
2X03_ROUND_70MIL = drill 0.9 pad 1.778: 1 -2.54,-1.27; 2 -2.54,1.27; 3 0,-1.27; 4 0,1.27; 5 2.54,-1.27; 6 2.54,1.27
1X10_OVALWAVE = drill 0.8 pad 1.5 long: 1 -11.43,0; 2 -8.89,0; 3 -6.35,0; 4 -3.81,0; 5 -1.27,0; 6 1.27,0; 7 3.81,0; 8 6.35,0; 9 8.89,0; 10 11.43,0
1X08_OVALWAVE = drill 0.8 pad 1.5 long: 1 -8.89,0; 2 -6.35,0; 3 -3.81,0; 4 -1.27,0; 5 1.27,0; 6 3.81,0; 7 6.35,0; 8 8.89,0
1X01_ROUND = drill 1 pad 1.676: 1 0,0
CHIPLED_0805_NOOUTLINE = smd 1.2 x 1.2: A 0,-1.05; C 0,1.05
INDUCTOR_1007 = smd 1.016 x 2.2: P$1 -1.127,0; P$2 1.127,0
LED3535 = smd 1 x 0.85: 1 -1.75,0.875; 2 -1.75,-0.875; 3 1.75,-0.875; 4 1.75,0.875
PANASONIC_D = smd 3.556 x 1.4: + 2.654,0; - -2.654,0
RESPACK_4X0603 = smd 0.45 x 0.9: 1 -1.3,-0.85; 2 -0.4,-0.85; 3 0.4,-0.85; 4 1.3,-0.85; 5 1.3,0.85; 6 0.4,0.85; 7 -0.4,0.85; 8 -1.3,0.85
EVQ-Q2_SMALLER = smd 2 x 1.2: A -3.1,-2; A' 3.1,-2; B -3.1,2; B' 3.1,2
SPDT_SMT_SSSS811101 = smd 0.7 x 1.5: A -2.25,1.75; B 0.75,1.75; C 2.25,1.75 | smd 1 x 0.8: SUP1 -3.65,1.1; SUP2 -3.65,-1.1; SUP3 3.65,1.1; SUP4 3.65,-1.1 | hole 0.9: -1.5,0; 1.5,0
SOT-23 = smd 0.787 x 0.889: 1 0.025,-1.016; 2 -0.94,1.016; 3 0.991,1.016
SOT223-R = smd 1.3 x 1.3: 1 -2.3,-3.05; 2 0,-3.05; 3 2.3,-3.05 | smd 3.6 x 1.3: 4 0,3.05
SOT23-DBV = smd 0.55 x 1.2: 1 -0.95,-1.3; 2 0,-1.3; 3 0.95,-1.3; 4 0.95,1.3; 5 -0.95,1.3
SOIC8_208MIL = smd 0.6 x 2.2: 1 -1.905,-3.315; 2 -0.635,-3.315; 3 0.635,-3.315; 4 1.905,-3.315; 5 1.905,3.315; 6 0.635,3.315; 7 -0.635,3.315; 8 -1.905,3.315
PQFN64-1 = smd 0.7 x 0.22: 1 -4.45,3.75; 2 -4.45,3.25; 3 -4.45,2.75; 4 -4.45,2.25; 5 -4.45,1.75; 6 -4.45,1.25; 7 -4.45,0.75; 8 -4.45,0.25; 9 -4.45,-0.25; 10 -4.45,-0.75; 11 -4.45,-1.25; 12 -4.45,-1.75; 13 -4.45,-2.25; 14 -4.45,-2.75; 15 -4.45,-3.25; 16 -4.45,-3.75; 33 4.45,-3.75; 34 4.45,-3.25; 35 4.45,-2.75; 36 4.45,-2.25; 37 4.45,-1.75; 38 4.45,-1.25; 39 4.45,-0.75; 40 4.45,-0.25; 41 4.45,0.25; 42 4.45,0.75; 43 4.45,1.25; 44 4.45,1.75; 45 4.45,2.25; 46 4.45,2.75; 47 4.45,3.25; 48 4.45,3.75 | smd 0.22 x 0.7: 17 -3.75,-4.45; 18 -3.25,-4.45; 19 -2.75,-4.45; 20 -2.25,-4.45; 21 -1.75,-4.45; 22 -1.25,-4.45; 23 -0.75,-4.45; 24 -0.25,-4.45; 25 0.25,-4.45; 26 0.75,-4.45; 27 1.25,-4.45; 28 1.75,-4.45; 29 2.25,-4.45; 30 2.75,-4.45; 31 3.25,-4.45; 32 3.75,-4.45; 49 3.75,4.45; 50 3.25,4.45; 51 2.75,4.45; 52 2.25,4.45; 53 1.75,4.45; 54 1.25,4.45; 55 0.75,4.45; 56 0.25,4.45; 57 -0.25,4.45; 58 -0.75,4.45; 59 -1.25,4.45; 60 -1.75,4.45; 61 -2.25,4.45; 62 -2.75,4.45; 63 -3.25,4.45; 64 -3.75,4.45 | smd 4.7 x 4.7: EXP 0,0
2X05_1.27MM_BOX_POSTS = smd 0.76 x 2.6: 1 -2.54,-2.15; 2 -2.54,2.15; 3 -1.27,-2.15; 4 -1.27,2.15; 5 0,-2.15; 6 0,2.15; 7 1.27,-2.15; 8 1.27,2.15; 9 2.54,-2.15; 10 2.54,2.15 | hole 1: -1.905,0; 1.905,0
4UCONN_20329_V2 = smd 1 x 2: BASE@1 -0.75,-2; BASE@2 0.75,-2 | smd 0.4 x 1.35: D+ 0,0.775; D- -0.65,0.775; GND 1.3,0.775; ID 0.65,0.775; VBUS -1.3,0.775 | drill 0.8 pad 1.143 offset: SPRT@1 -3.3,0.9; SPRT@2 3.3,0.9 | drill 0.9 pad 2.413 square: SPRT@3 -3.6,-1.9; SPRT@4 3.6,-1.9 | hole 0.7: -1.95,0; 1.95,0
XTAL3215 = smd 1.1 x 1.9: P$1 1.2,0; P$2 -1.2,0
DCJACK_2MM_PTH = drill 0.9 pad 2.7 long: GND 7.35,0; GNDBREAK 10.75,-4.8; PWR 13.6,0
WROOM32 = smd 1.5 x 0.9: 1 -8.6,5; 2 -8.6,3.73; 3 -8.6,2.46; 4 -8.6,1.19; 5 -8.6,-0.08; 6 -8.6,-1.35; 7 -8.6,-2.62; 8 -8.6,-3.89; 9 -8.6,-5.16; 10 -8.6,-6.43; 11 -8.6,-7.7; 12 -8.6,-8.97; 13 -8.6,-10.24; 14 -8.6,-11.51; 25 8.6,-11.51; 26 8.6,-10.24; 27 8.6,-8.97; 28 8.6,-7.7; 29 8.6,-6.43; 30 8.6,-5.16; 31 8.6,-3.89; 32 8.6,-2.62; 33 8.6,-1.35; 34 8.6,-0.08; 35 8.6,1.19; 36 8.6,2.46; 37 8.6,3.73; 38 8.6,5 | smd 0.9 x 1.5: 15 -5.7,-12.9; 16 -4.43,-12.9; 17 -3.16,-12.9; 18 -1.89,-12.9; 19 -0.62,-12.9; 20 0.65,-12.9; 21 1.92,-12.9; 22 3.19,-12.9; 23 4.46,-12.9; 24 5.73,-12.9 | smd 6 x 6: P$1 0.34,-2.7

### Placement (x,y rotation side)
AD  57.18,2.54 0 top
C1  34.9,23.34 225 top
C2  36.6,16.13 180 top
C3  47.02,11.43 90 top
C4  47.8,23.29 315 top
C5  43.28,19.96 0 top
C6  44.26,9.25 180 top
C7  46.28,19.86 180 top
C8  37.84,27.59 135 top
C9  33.77,24.57 225 top
C10  44.24,40.9 225 top
C11  36.94,33.72 315 top
C12  24,9.55 270 top
C13  18.06,42.8 270 top
C14  13.76,11.7 180 top
C15  50.62,25.68 135 top
C16  58.8,31.67 270 top
C17  11.43,49.43 270 top
C18  13.87,10.16 0 top
C19  13.87,8.26 0 top
C20  13.87,6.35 0 top
D1  18.44,7.47 180 top
ECC1  22.89,41.91 270 top
F2  9.19,40.39 0 top
FB2  1.8,44.83 270 top
FD1  1.42,49.53 0 top
FD2  66.18,4.55 0 top
FD3  1.7,1.86 0 top
GROUND1  7.14,44.7 180 bottom
IC1  9.55,35.05 0 top
IC3  28.55,27.76 270 top
ICSP  64.67,27.94 270 top
IOH  30.25,50.8 0 top
IOL  54.64,50.8 0 top
JP1  22.25,8.74 0 top
L  64.31,13.23 270 top
L1  36.55,26.14 315 top
LED1  14.5,42.8 180 top
ON  64.31,20.35 90 top
PC1  28.12,11.05 90 top
PC2  31.29,19.23 0 top
POWER  36.86,2.54 0 top
R1  32,27.41 90 top
R2  58.85,19.08 90 top
R4  50.06,16.26 180 top
R5  58.78,35.33 270 top
R7  17.04,9.91 270 top
R10  28.85,41.4 90 top
R11  28.27,30.51 0 top
R15  44.96,16.36 180 top
RESET  6.38,49.4 180 top
RXLED  64.31,15.52 90 top
SJ1  50.79,22.3 225 top
SW1  21.97,2.84 0 top
T2  19.71,9.91 90 top
TR1  29.13,24.23 270 top
TXLED  64.31,17.81 90 top
U1  35.69,11.05 270 top
U2  43.84,11.43 270 top
U3  55.55,34.59 180 top
U$1  44.93,32.31 135 top
U$27  [METROM4_AIRLIFT_LITE_BOT]  68.61,0 0 bottom
U$39  [METROM4_AIRLIFT_LITE_TOP]  0.03,0 0 top
X2  54.89,12.83 0 top
X3  4.34,38.1 270 top
X4  44.68,21.87 180 top
X5  -3.28,7.75 0 top
X6  12.65,22.89 90 top

### Tracks (layer width: path | path; a pad name or v marks a point on that pad's centre or on a via)
3.3V  (via drill 0.39, 0.5)
  Top 0.254: U$1.34 43.71,38.13 43.71,40.22 C10.2 43.21,40.73 v43.21,41.91 | C16.2 57.91,30.82 U3.8 57.45,33.16 v57.63,33.33 R5.2 59.78,34.48 59.97,34.67 59.97,38.61 55.14,43.43 v54.89,43.43 | v51.26,35.38 50.47,35.38 U$1.21 48.92,33.83 48.92,32.89 49.3,32.51 49.3,32 47.4,30.1 47.4,29.5 U$1.8 50.02,26.87 C15.2 49.81,26.07 49.81,24.26 51.23,22.84 SJ1.1 52.45,21.72 v52.48,21.72 | C20.1 C19.1 C18.1 C14.2 9.79,11.7 v9.36,12.13 8.92,12.57 X6.2 | U$1.48 38.82,33.12 C11.2 37.07,32.64 36.61,32.64 34.23,35.02 v34.23,35.48 | C13.1 18.03,43.67 LED1.2 16.25,44.55 v17.3,45.59 21.11,45.59 22.89,43.81 ECC1.8 | RXLED.A TXLED.A ON.A 65.36,21.91 v65.3,21.97 | R1.3 32.29,27.81 32.03,28.07 32.03,29.08 | 32.03,29.08 31.78,29.34 30.47,29.34 IC3.5 | v41.81,8.38 42.67,9.25 C6.2 44.09,9.93 44.09,11.94 44.54,12.38 U2.5 | v32.03,29.72 32.03,29.08 | U$1.56 40.28,28.02 40.28,26.68 38.94,25.34 38.94,25.32 35.97,22.35 v36.09,22.23 36.09,20.7 44.41,12.38 U2.5 | R4.2 49.21,13.81 | 49.21,13.81 X2.1 | 49.21,13.81 49.12,13.91 v48.98,13.91 47.33,12.26 47.21,12.38 C3.2 U2.5 | IC1.5 8.6,35.97 8.53,35.91 8.53,35.31 v8.28,35.05 | R10.4 29.7,42.29 | 29.7,42.29 R10.3 29.36,41.8 28.92,41.36 28.92,40.44 | R10.7 28.37,41 28.92,40.44 | R10.1 29.27,40.1 28.92,40.44 | v31.01,42.16 29.83,42.16 29.7,42.29
  Bottom 0.254: v51.26,35.38 51.26,34.1 53.7,31.67 56.59,31.67 57.43,32.51 57.43,33.13 v57.63,33.33 57.63,27.87 63.53,21.97 v65.3,21.97 | v32.03,29.72 31.9,29.59 31.9,26.67 36.09,22.48 v36.09,22.23 | v54.89,43.43 54.51,43.05 44.98,43.05 43.84,41.91 | 43.84,41.91 v43.21,41.91 | POWER.2 30.51,4.45 | 30.51,4.45 35.46,4.45 35.52,4.38 | 35.52,4.38 35.59,4.32 POWER.4 | v34.23,35.48 34.04,35.28 26.08,35.28 17.3,44.07 v17.3,45.59 11.33,45.59 7.14,41.4 7.14,35.05 | 7.14,35.05 7.14,33.27 9.36,31.05 v9.36,12.13 10.31,11.18 14.76,11.18 21.49,4.45 30.51,4.45 | v52.48,21.72 52.35,21.72 49.81,19.18 49.81,14.73 v48.98,13.91 | 35.52,4.38 35.59,4.45 39.9,4.45 41.81,6.35 v41.81,8.38 | v8.28,35.05 7.14,35.05 | 43.84,41.91 42.82,40.89 32.92,40.89 31.65,42.16 v31.01,42.16
!RESET  (via drill 0.39, 0.5)
  Top 0.254: U$1.52 38.77,29.34 37.24,29.34 30.63,35.94 v30.63,36.07 | POWER.3 33.05,5.21 34.57,6.73 35.71,6.73 v35.97,6.99 | v39.01,7.24 39.27,6.99 57.56,6.99 58.83,8.26 58.83,13.58 X2.10 58.83,16.37 58.83,20.83 ICSP.5 61.11,27.69 61.11,39.37 v59.33,41.15 | RESET.B' RESET.B 10.25,47.4 C17.2 13.61,46.39 13.61,40.77 15.17,39.21 27.97,39.21 | 27.97,39.21 30.47,39.21 30.89,39.62 v30.89,39.73 | R10.8 28,39.25 27.97,39.21
  Bottom 0.254: v39.01,7.24 36.22,7.24 v35.97,6.99 | v59.33,41.15 57.95,42.53 45.21,42.53 42.92,40.24 31.39,40.24 v30.89,39.73 30.63,39.73 v30.63,36.07
+5V
  Top 0.254: U1.2 35.59,11.05 | 35.59,11.05 U1.4 | PC2.+ 34.09,19.08 | 34.09,19.08 35.65,17.52 C2.2 35.65,11.12 35.59,11.05 | POWER.5 38.13,6.35 | 38.13,6.35 38.13,10.44 U1.4 | U1.4 38.77,11.05 39.33,10.48 U2.3 43.4,10.48 43.59,10.67 43.59,12.19 43.4,12.38 U2.1 | TR1.2 34.09,21.23 34.09,19.08 | 38.13,6.35 58.83,6.35 63.53,11.05 65.68,11.05 66.64,12 66.64,22.16 64.67,24.13 64.67,29.21 ICSP.2
A0  (via drill 0.5)
  Top 0.254: U$1.3 46.63,26.72 46.63,24.89 46.13,24.38 46.13,23.62 46.89,22.86 46.89,21.34 47.52,20.7 48.03,20.7 49.68,19.05 v51.08,19.05
  Bottom 0.254: v51.08,19.05 51.08,18.54 50.32,17.78 50.32,3.05 AD.1
A1  (via drill 0.5)
  Top 0.254: U$1.14 51.8,29.34 v52.35,29.34
  Bottom 0.254: v52.35,29.34 52.73,29.34 53.75,28.32 53.75,19.56 54.89,18.41 54.89,4.06 AD.2
A2  (via drill 0.5)
  Top 0.254: v51.84,30.48 51.36,30.48 U$1.15
  Bottom 0.254: AD.3 55.4,3.05 55.4,18.67 54.25,19.81 54.25,28.7 52.48,30.48 v51.84,30.48
A3  (via drill 0.5)
  Top 0.254: U$1.61 40.54,24.74 40.54,19.56 41.86,18.24 51.54,18.24 52.35,19.05 53.87,19.05 55.78,17.14 v56.41,17.14
  Bottom 0.254: v56.41,17.14 58.45,15.11 AD.4
A4  (via drill 0.5)
  Top 0.254: U$1.11 57.17,21.84 v57.68,21.84
  Bottom 0.254: v57.68,21.84 60.99,18.54 AD.5
A5  (via drill 0.5)
  Top 0.254: U$1.12 56.73,22.99 v57.81,22.99
  Bottom 0.254: v57.81,22.99 63.53,17.27 AD.6
AREF  (via drill 0.5)
  Top 0.254: U$1.4 47.14,26.92 47.14,24.51 46.86,24.23 C4.1 47.31,24 48.39,24 50.25,22.14 SJ1.2 51.08,20.93 54.42,20.93 v55.04,20.32 | v55.52,28.57 59.33,28.57 60.6,29.84 60.6,38.99 59.23,40.37 59.01,40.37 58.55,40.82 58.55,41.04 55.14,44.45 54.23,44.45 v53.62,43.84
  Bottom 0.254: v55.04,20.32 54.71,20.65 54.71,28.26 55.03,28.57 v55.52,28.57 | IOH.3 33.32,41.38 41.51,41.38 42.91,42.78 44.06,42.78 44.82,43.54 53.32,43.54 v53.62,43.84
D0  (via drill 0.5)
  Top 0.254: U$1.44 35.84,38.93 v35.84,45.59
  Bottom 0.254: v35.84,45.59 41.55,45.59 43.08,47.12 61.24,47.12 63.65,49.53 63.65,50.67 IOL.8
D1  (via drill 0.5)
  Top 0.254: U$1.43 36.73,38.75 v36.73,46.61
  Bottom 0.254: v36.73,46.61 41.81,46.61 42.82,47.62 59.97,47.62 60.99,48.64 IOL.7
D2  (via drill 0.5)
  Top 0.254: U$1.40 39.14,38.46 39.14,47.24 39.32,47.42 v39.44,47.42
  Bottom 0.254: v39.44,47.42 41.86,47.42 42.62,48.18 57.98,48.18 58.45,48.64 IOL.6
D3  (via drill 0.5)
  Top 0.254: U$1.39 39.65,38.66 39.65,46.35 40.54,47.24 v40.54,48.26
  Bottom 0.254: v40.54,48.26 41.81,48.26 42.32,48.77 55.91,48.77 IOL.5
D4
  Top 0.254: U$1.26 50.52,38.97 50.52,47.95 IOL.4
D5
  Top 0.254: U$1.27 50.06,39.22 50.06,50.04 IOL.3
D6
  Top 0.254: U$1.28 49.61,39.46 49.61,49.86 48.67,50.8 IOL.2
D7  (via drill 0.5)
  Top 0.254: U$1.25 47.9,35.68 51.11,38.89 51.11,44.04 51.37,44.29 v51.37,44.42 | v46.63,44.32 46.63,49.91 IOL.1
  Bottom 0.254: v51.37,44.42 46.73,44.42 v46.63,44.32
D8  (via drill 0.5)
  Top 0.254: U$1.42 37.62,38.57 v37.62,48.13
  Bottom 0.254: IOH.10 39.01,48.13 v37.62,48.13
D9
  Top 0.254: U$1.41 38.51,38.38 38.51,50.16 IOH.9
D10  (via drill 0.5)
  Top 0.254: U$1.37 41.05,38.67 41.05,42.42 41.05,42.55 41.43,42.93 41.43,43.69 41.05,44.07 v40.54,44.58
  Bottom 0.254: v40.54,44.58 40.41,44.7 34.96,44.7 34.96,47.25 36.6,48.9 IOH.8
D11  (via drill 0.5)
  Top 0.254: U$1.38 40.54,38.47 v40.54,43.31
  Bottom 0.254: v40.54,43.31 39.78,44.07 34.7,44.07 34.06,44.7 IOH.7
D12  (via drill 0.5)
  Top 0.254: U$1.36 41.55,38.87 41.55,42.29 42.06,42.8 42.06,44.56 v42.21,44.7
  Bottom 0.254: v42.21,44.7 41.32,43.81 41.32,42.8 40.81,42.29 35.71,42.29 31.52,46.48 IOH.6
D13  (via drill 0.5)
  Top 0.254: U$1.35 42.06,39.07 42.06,42.15 42.52,42.61 42.52,43.11 v42.97,43.56 | R2.8 57.07,17.77 v56.4,18.45
  Bottom 0.254: IOH.5 28.85,50.67 28.85,48.39 35.41,41.83 41.32,41.83 41.32,41.91 v42.97,43.56 44.62,45.21 57.05,45.21 60.48,41.78 60.48,38.35 67.21,31.62 67.21,21.08 66.07,19.94 63.02,19.94 58.65,24.3 56.97,24.3 56.29,23.62 56.29,19.18 56.4,19.07 v56.4,18.45
D+
  Top 0.254: X3.D+ 6.25,38.1 6.44,38.29 35.05,38.29 39.48,33.87 39.49,33.87 U$1.46
D-
  Top 0.254: U$1.45 35.31,38.75 X3.D-
ESP_BUSY  (via drill 0.5)
  Top 0.254: X6.9 17.81,13.2 18.69,12.32 25.68,12.32 v26.44,13.08 | U$1.5 47.65,27.12 47.65,25.65 v48.03,25.27
  Bottom 0.254: v48.03,25.27 48.03,23.24 37.62,12.83 26.44,12.83 26.31,12.95 v26.44,13.08
ESP_CS  (via drill 0.39, 0.5)
  Top 0.254: U$1.32 45.87,38.56 v45.87,39.62 | IC1.1 8.6,34.23 9.3,34.92 13.49,34.92 14.5,35.94 16.92,35.94 17.81,35.05 v18.69,35.05 19.08,34.67 19.08,33.59 X6.29 | v32.66,39.51 32.66,39.87 31.54,41 R10.2
  Bottom 0.254: v45.87,39.62 45.11,39.62 40.16,34.67 37.5,34.67 | 37.5,34.67 19.08,34.67 v18.69,35.05 | 37.5,34.67 v32.66,39.51
ESP_GPIO0  (via drill 0.5)
  Top 0.254: U$1.62 41.17,24.67 41.17,23.37 v41.55,22.99 | X6.25 25.04,30.61 v25.68,30.61
  Bottom 0.254: v41.55,22.99 40.16,22.99 35.1,28.05 34.63,28.05 33.91,28.76 33.91,29.36 32.54,30.73 31.52,30.73 30.63,29.84 29.87,29.84 29.11,30.61 v25.68,30.61
ESP_MISO
  Top 0.254: X6.37 8.92,32.13 9.55,32.77 IC1.2
ESP_RESET  (via drill 0.5)
  Top 0.254: X6.3 10.19,13.46 10.82,12.83 15.52,12.83 16.66,11.68 v26.19,11.68 | U$1.6 48.41,27.07 48.41,26.67 v48.54,26.8 | v47.33,16.32 47.33,16.36 R15.1
  Bottom 0.254: v48.54,26.8 49.3,26.04 49.3,18.29 v47.33,16.32 41.81,10.79 27.08,10.79 v26.19,11.68
ESP_RTS  (via drill 0.5)
  Top 0.254: U$1.50 39.14,31.11 36.73,31.11 30.89,36.96 24.92,36.96 23.65,35.69 v23.52,35.69 | v16.54,35.05 16.41,34.92 16.41,31.62 X6.31
  Bottom 0.254: v16.54,35.05 17.55,35.05 18.44,35.94 23.27,35.94 v23.52,35.69
ESP_RXD  (via drill 0.5)
  Top 0.254: v51.84,31.62 51.65,31.82 U$1.16 | X6.35 11.46,33.26 12.1,33.91 12.98,33.91 13.87,33.02 v14.76,33.02
  Bottom 0.254: v51.84,31.62 51.33,31.62 50.44,32.51 22.5,32.51 22,32 15.77,32 v14.76,33.02
ESP_TXD  (via drill 0.5)
  Top 0.254: U$1.13 52.23,28.19 v52.73,28.19 | v12.73,33.02 X6.34
  Bottom 0.254: v52.73,28.19 51.97,28.19 48.16,32 22.76,32 22.25,31.5 14.63,31.5 13.11,33.02 v12.73,33.02
FLASH_CS
  Top 0.254: U$1.24 52.85,39.88 56.92,39.88 57.45,39.34 57.45,38.23 | 57.45,38.23 U3.1 | R5.1 58.78,36.91 57.45,38.23
FLASH_IO0
  Top 0.254: U$1.17 52.88,32.81 53.64,32.04 U3.5
FLASH_IO1
  Top 0.254: U$1.18 50.74,33.53 53.24,33.53 56.18,36.47 U3.2
FLASH_IO2
  Top 0.254: U$1.19 50.54,34.04 52.98,34.04 54.91,35.97 U3.3
FLASH_IO3  (via drill 0.5)
  Top 0.254: U$1.20 50.36,34.56 52.03,34.56 v52.28,34.82 | v56.16,33.4 56.16,31.3 U3.7
  Bottom 0.254: v52.28,34.82 52.28,34.31 54.46,32.13 55.4,32.13 56.16,32.89 v56.16,33.4
FLASH_SCK  (via drill 0.5)
  Top 0.254: U$1.23 50.51,36.83 v51.97,36.83 | v54.89,33.27 54.91,33.25 U3.6
  Bottom 0.254: v51.97,36.83 52.35,36.83 54.76,34.42 54.76,33.4 v54.89,33.27
GND  (via drill 0.5)
  Top 0.254: U$1.7 44.93,31.25 44.93,32.13 | 44.93,32.13 U$1.EXP | U$1.54 42.98,32.13 44.6,32.13 | 44.6,32.13 44.93,32.13 | U$1.47 40.26,32.38 44.35,32.38 44.6,32.13 | U$1.22 46.7,32.31 U$1.EXP | U$1.33 44.86,37.69 44.86,32.51 44.93,32.44 U$1.EXP | U$1.EXP 44.93,34.49 v44.98,34.54 | C4.2 48.92,22.17 48.92,21.59 v47.78,21.59
  Top 0.406: X6.38 6.89,31.48 6.89,36.7 6.79,36.8 X3.GND
  other vias: 7.65,29.84 7.52,27.69 7.39,25.02 7.77,21.97 7.39,19.43 7.77,16.51 13.11,20.83 17.68,25.4 12.98,25.53 15.14,23.37 17.55,20.83 23.65,17.02 15.77,16.26 10.44,16.38 10.44,28.7 16.66,29.21 21.36,29.21 23.14,24.51 20.35,20.7 13.36,18.41 10.95,19.94 10.69,24.51 14.38,28.45 20.22,25.91 44.86,29.84 52.1,24.26 65.43,11.94 60.35,23.88 56.79,26.16 41.68,21.21 42.32,16.26 47.52,14.86 27.33,21.08 27.33,17.27 30.51,7.11 26.19,6.86 40.92,11.94 40.67,8.64 14,34.16 14.12,36.7 48.41,19.18 64.29,19.05 62.13,11.56 59.97,12.83 56.92,8.38 52.48,8.38 46.51,8.64 58.7,29.59 14.5,42.8 23.27,44.96 22.89,48.26 33.68,42.29 43.46,45.85 59.08,45.72 17.68,40.51 52.1,19.94 9.55,36.32 12.47,40.26 67.08,33.27
  pour Bottom (rank 3): 0.03,53.34 68.61,53.34 68.61,0 0.03,0 0.03,11.3 6.76,11.3 6.76,32.77 0.03,32.77
  pour Top (rank 3): 0.03,53.34 68.61,53.34 68.61,0 0.03,0 0.03,11.3 6.76,11.3 6.76,32.77 0.03,32.77
MISO  (via drill 0.5)
  Top 0.254: U$1.31 46.89,38.87 v46.89,40.77 | v12.34,36.45 v12.35,36.45 10.59,36.45 IC1.4
  Bottom 0.254: ICSP.1 63.27,30.61 63.27,33.4 55.91,40.77 v46.89,40.77 47.02,40.64 47.02,38.48 42.7,34.16 15.39,34.16 13.23,36.32 12.47,36.32 v12.34,36.45
MOSI  (via drill 0.5)
  Top 0.254: X6.13 22.89,13.2 22.94,13.16 25.12,13.16 25.55,13.59 25.55,14.35 26.31,15.11 v26.31,15.24 | v48.41,41.66 48.77,41.29 48.77,39.4 46.49,37.11 U$1.29 | ICSP.4 67.21,26.67 67.21,11.68 65.94,10.41 64.16,10.41 59.21,5.46 39.12,5.46 v39.01,5.57
  Bottom 0.254: v48.41,41.66 56.03,41.66 64.03,33.66 64.03,32.38 64.67,31.75 64.67,29.08 65.81,27.94 ICSP.4 | v39.01,5.57 30.4,5.57 25.4,10.56 25.4,12.01 25.43,12.03 25.43,14.35 v26.31,15.24
N$1
  Top 0.254: R2.1 62,15.48 62,14.49 L.A
N$2  (via drill 0.5)
  Top 0.254: FB2.1 2.89,45.78 v3.96,44.7
  Bottom 0.254: v3.96,44.7 GROUND1.1
N$3
  Top 0.254: R2.4 59.73,20.34 ON.C
N$4
  Top 0.254: U$1.55 39.78,28.22 39.78,27.05 38.07,25.34 L1.P$2
N$5
  Top 0.254: R2.2 59.96,18.68 63.12,15.52 RXLED.C
N$7
  Top 0.254: R2.3 60.2,19.48 61.87,17.8 TXLED.C
N$9
  Top 0.254: U$1.1 45.43,25.25 45.04,24.86 45.04,23.81 43.48,22.24 X4.P$1 42.43,20.82 C5.1
N$10
  Top 0.254: R1.6 27.3,27.81 IC3.2 IC3.1 27.42,28.87 R11.1 27.18,30.5 21.26,36.43 16.68,36.43 15.28,37.83 6.64,37.83 6.26,37.45 X3.ID
N$11
  Top 0.254: R1.8 R1.7 30.04,27.01 IC3.4 29.38,26.81 29.24,26.67 29.24,24.16 TR1.3
N$12
  Top 0.254: U$1.2 46.13,26.52 46.13,25.15 45.62,24.64 45.62,21.8 45.95,21.8 X4.P$2 45.88,21.49 47.13,20.24 C7.1
N$15
  Top 0.254: D1.C 18.79,8.97 T2.2 18.6,9.06 R7.2
NEOPIX  (via drill 0.5)
  Top 0.254: U$1.49 36.79,31.82 30.89,37.72 17.3,37.72 v16.92,37.34 | v16.15,40.39 16.15,41.83 LED1.1
  Bottom 0.254: v16.92,37.34 16.79,37.34 16.15,37.97 v16.15,40.39
PWR_SWITCH
  Top 0.254: R7.1 17.18,10.9 T2.3 18.69,10.54 20.5,8.74 JP1.1 22.72,8.27 SW1.B
PWRIN  (via drill 0.5)
  Top 0.406: v16.66,5.71 16.66,7.4 D1.A
  Bottom 0.406: X5.PWR 14.5,7.75 16.54,5.71 v16.66,5.71
RXLED
  Top 0.254: U$1.9 56.67,20.93 56.67,19.43 57.42,18.68 R2.7
SCK  (via drill 0.5)
  Top 0.254: U$1.30 47.99,39.26 v47.99,39.92 | v17.41,33.25 17.79,32.87 17.79,31.5 X6.30
  Bottom 0.254: ICSP.3 61.49,29.84 61.49,32.63 55.35,38.78 49.13,38.78 v47.99,39.92 47.86,39.79 47.86,38.68 42.84,33.66 17.82,33.66 v17.41,33.25
SCL  (via drill 0.5)
  Top 0.254: v26.95,36.07 26.95,35.56 27.52,34.99 28.66,34.99 34.82,28.83 v34.95,28.83 | U$1.64 44.44,24.22 44.35,24.13 v44.09,24.13 | IOH.1 18.82,49.53 22.53,45.83 25.7,45.83 28,43.52 R10.5 27.74,42.7 26.31,41.27 ECC1.6
  Bottom 0.254: IOH.1 18.82,44.2 v26.95,36.07 | v44.09,24.13 43.84,23.88 40.16,23.88 35.08,28.96 v34.95,28.83
SDA  (via drill 0.5)
  Top 0.254: v28.6,36.07 34.06,30.61 34.44,30.61 v35.08,29.97 | v43.08,24.89 43.08,25.87 U$1.63 | ECC1.5 26.82,40.01 27.08,40.26 27.08,41.27 27.6,41.8 R10.6 28.37,41.8 28.85,42.29 28.85,43.32 25.89,46.28 22.72,46.28 21.36,47.64 IOH.2
  Bottom 0.254: IOH.2 21.36,43.31 v28.6,36.07 | v35.08,29.97 40.54,24.51 42.7,24.51 v43.08,24.89
SWCLK
  Top 0.254: U$1.57 40.92,27.95 40.92,26.67 39.4,25.15 39.4,19.18 41.3,17.27 51.08,17.27 | X2.4 53.62,15.62 53.75,15.75 53.62,15.88 53.62,16 52.35,17.27 51.08,17.27 | R4.1 51.08,16.42 51.08,17.27
SWDIO  (via drill 0.5)
  Top 0.254: U$1.58 41.43,27.75 41.43,26.42 39.9,24.89 39.9,19.43 41.55,17.78 52.22,17.78 v52.6,18.16 | X2.2 51.98,14.61 v51.21,14.61
  Bottom 0.254: v52.6,18.16 51.21,16.76 v51.21,14.61
SWO  (via drill 0.39, 0.5)
  Top 0.254: U$1.59 42.16,27.77 v42.16,27.39 | v54.11,17.4 54.89,16.62 X2.6
  Bottom 0.254: v42.16,27.39 43.47,28.7 49.3,28.7 53.29,24.71 53.29,19.23 54.11,18.41 v54.11,17.4
TXLED
  Top 0.254: U$1.10 57.18,21.13 57.18,19.79 57.49,19.48 R2.6
USB_HOSTEN  (via drill 0.5)
  Top 0.254: U$1.51 38.95,30.23 v37.87,30.23 | R11.2 30.02,30.5 v30.63,31.11
  Bottom 0.254: v37.87,30.23 36.73,31.37 30.89,31.37 v30.63,31.11
USBVCC  (via drill 0.5)
  Top 0.254: F2.2 10.62,42.49 v10.57,42.55 | v28.09,25.4 28.12,25.38 TR1.1
  Bottom 0.254: v10.57,42.55 10.57,30.99 21.87,30.99 27.46,25.4 v28.09,25.4
USHIELD
  Top 0.254: X3.SPRT@3 1.8,42.34 FB2.2
  pour Bottom: 0.15,43.05 0.15,32.89 6.38,32.89 6.38,43.05
  pour Top (rank 2): 0.15,43.05 0.15,32.89 6.38,32.89 6.38,43.05
VBUS
  Top 0.254: X3.VBUS 6.79,39.4 F2.1
VDDCORE
  Top 0.254: U$1.53 38.97,28.83 37.87,28.83 C8.2 37.01,28.19 36.11,27.29 | 36.11,27.29 L1.P$1 | 36.11,27.29 36.11,26.91 C9.1 34.41,25.18 C1.1
VIN  (via drill 0.5)
  Top 0.305: C12.1
  Top 0.406: T2.1 21.34,10.54 24.16,10.54 | 28.12,12.42 28.12,11.96 26.7,10.54 24.16,10.54 | 28.12,12.42 PC1.+ 29.4,14.99 30.63,14.99 v30.76,14.86 | 28.12,12.42 v30.7,9.84 31.79,8.75 U1.3 | v31.78,24.89 32.85,25.97 R1.1 | C12.1 24.16,10.54
  Bottom 0.406: v30.7,9.84 43.14,9.84 45.75,7.24 POWER.8 | v30.76,14.86 31.65,15.75 31.65,24.77 v31.78,24.89

### Text on the board
tPlace: ESP32
tNames: SCL | SDA | AREF | GND | 1 | ANALOG IN | IOREF | RESET | 3V3 | 5V | GND | VIN | A0 | A1 | A2 | A3 | A4 | A5
214bmp: D:/SmartProjects/Snc/a4_bn_logo2.bmp